# Altium schematic sheet 2312_Ethernet.SchDoc
size A3; Author: Miguel Santos; Organization: ETML-ES; Address1: Avenue Recordon 1; Address2: 1004 Lausanne; Address3: Switzerland; SheetNumber: 4; SheetTotal: 7; Version: 1.0; SPICEModelCacheRYIINKWG: <root> / <DocumentId>RYIINKWG</DocumentId> / </root>
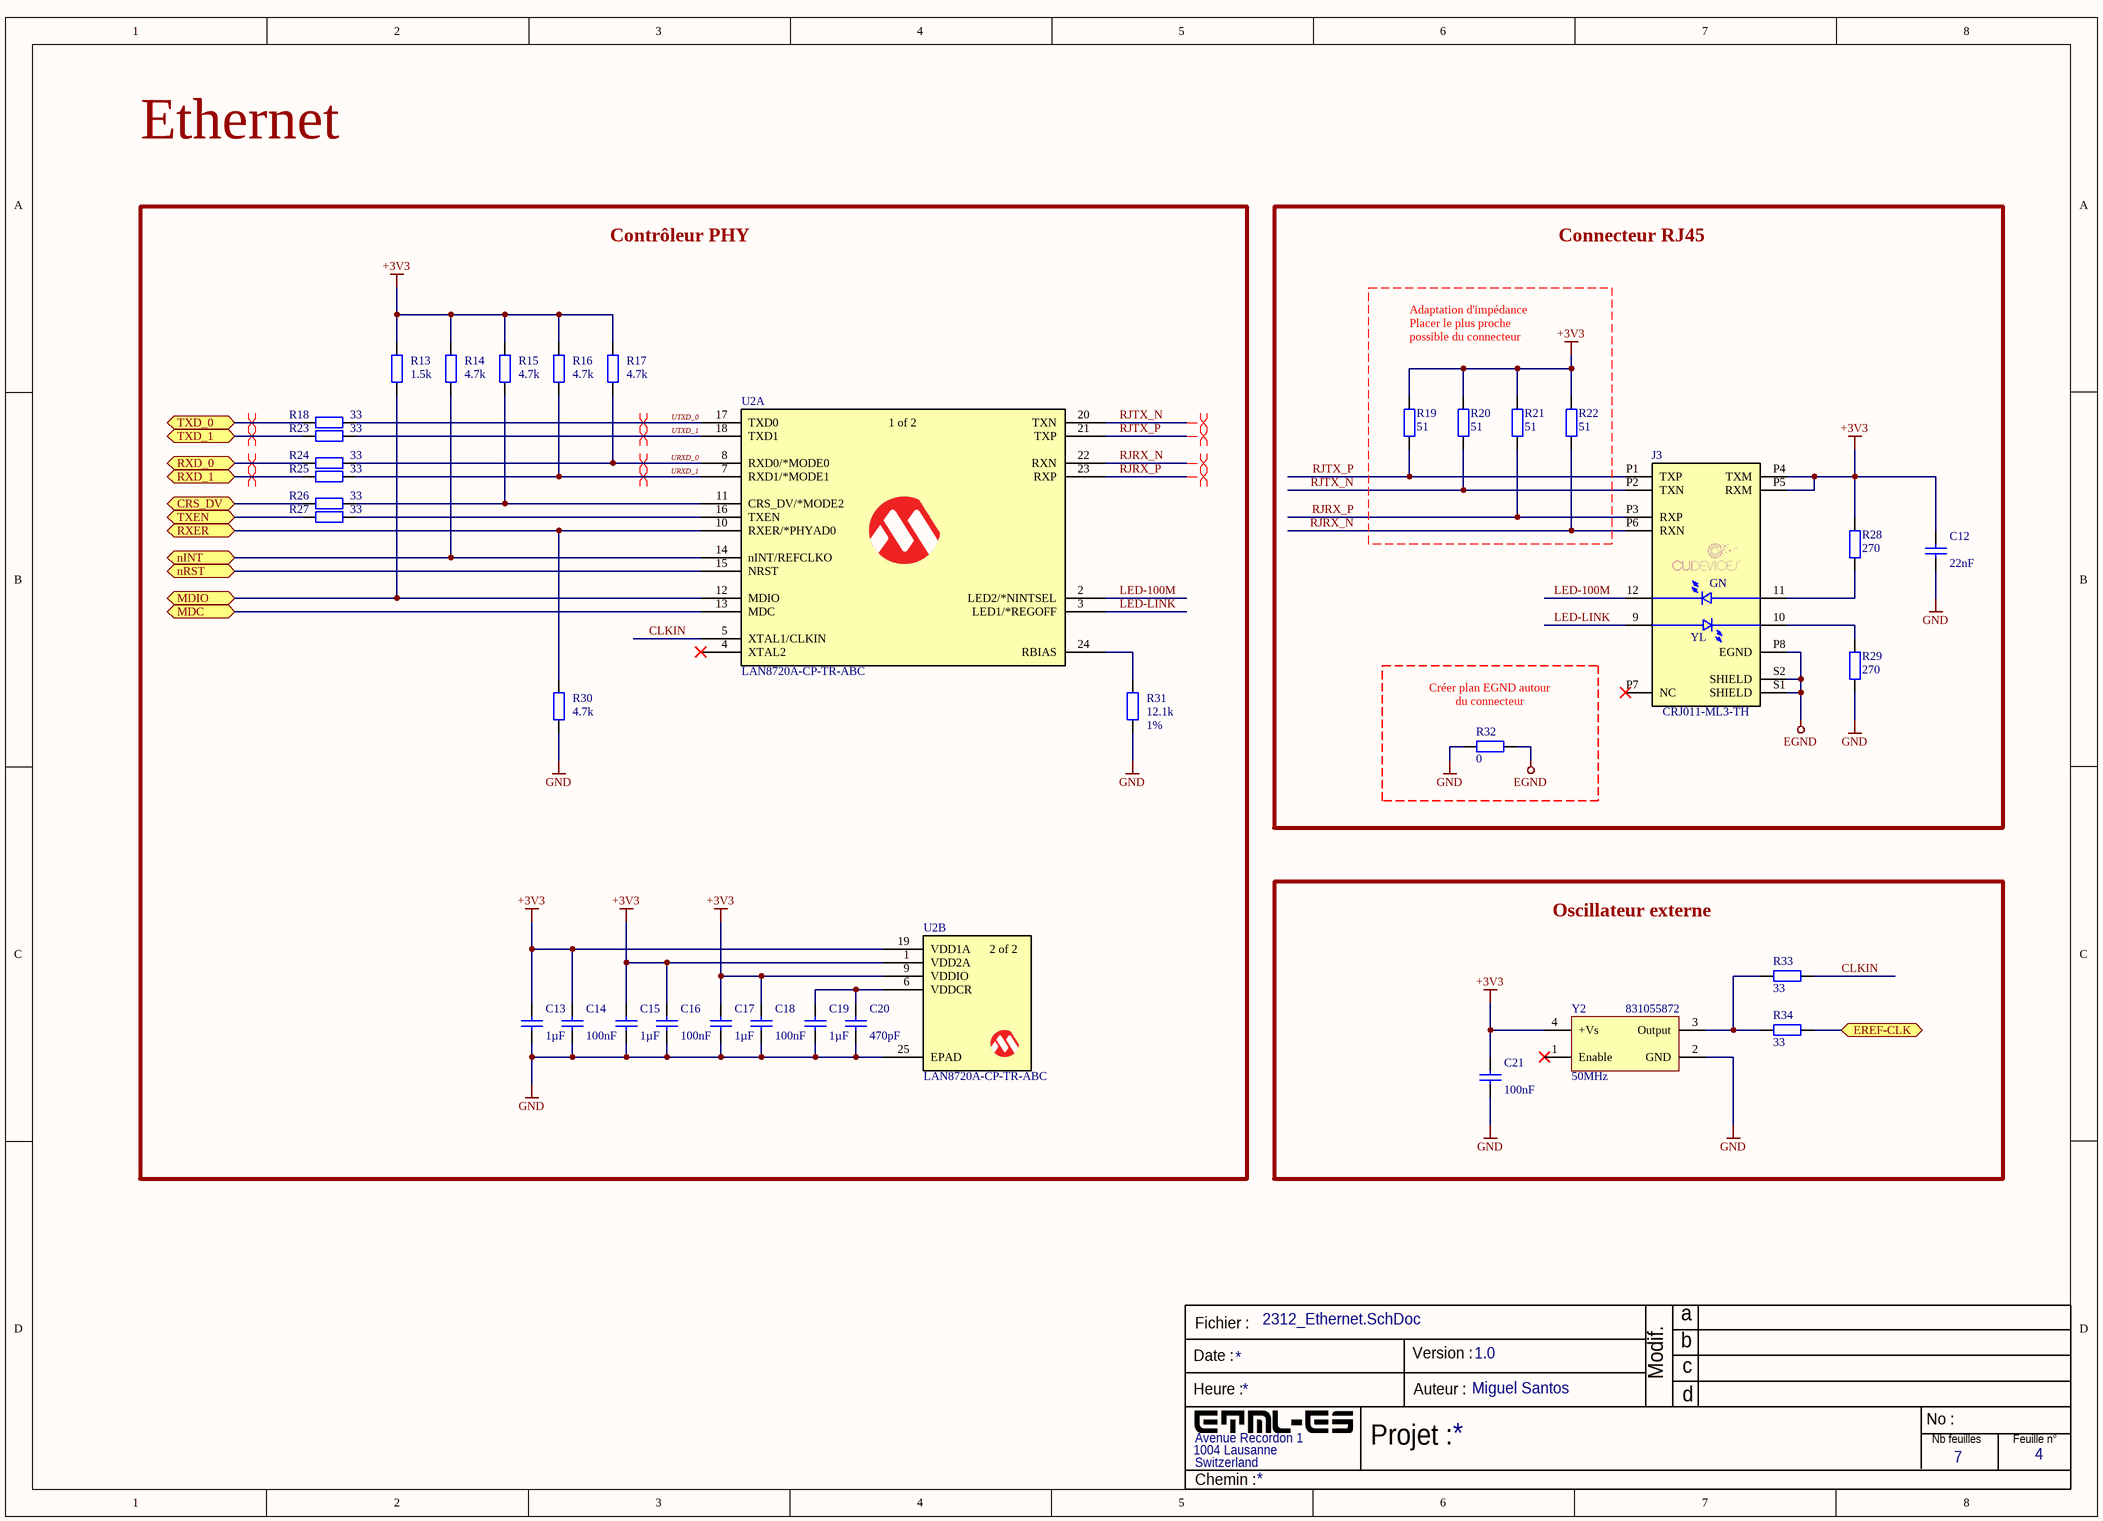
[diagram p0: 2312_Ethernet.SchDoc]

## Parts
C12  Capacitance: 22nF  [WCAP-CSGP_0805_L2W1.25H0.8_Reflow]  (hidden comment: 885012207013)
C13  Capacitance: 1µF  [WCAP-CSGP_0805_L2W1.25H1.25]  (hidden comment: 885012207022)
C14  Capacitance: 100nF  [WCAP-CSGP_0805_L2W1.25H0.8_Reflow]  (hidden comment: 885012207016)
C15  Capacitance: 1µF  [WCAP-CSGP_0805_L2W1.25H1.25]  (hidden comment: 885012207022)
C16  Capacitance: 100nF  [WCAP-CSGP_0805_L2W1.25H0.8_Reflow]  (hidden comment: 885012207016)
C17  Capacitance: 1µF  [WCAP-CSGP_0805_L2W1.25H1.25]  (hidden comment: 885012207022)
C18  Capacitance: 100nF  [WCAP-CSGP_0805_L2W1.25H0.8_Reflow]  (hidden comment: 885012207016)
C19  Capacitance: 1µF  [WCAP-CSGP_0805_L2W1.25H1.25]  (hidden comment: 885012207022)
C20  Capacitance: 470pF  [WCAP-CSGP_0805_L2W1.25H0.8_Reflow]  (hidden comment: 885012007007)
C21  Capacitance: 100nF  [WCAP-CSGP_0805_L2W1.25H0.8_Reflow]  (hidden comment: 885012207016)
J3  CRJ011-ML3-TH  [CUI_CRJ011-ML3-TH]
R13  Resistance: 1.5k  [2312-RES-0805]  (hidden comment: RES-0805)
R14  Resistance: 4.7k  [2312-RES-0805]  (hidden comment: RES-0805)
R15  Resistance: 4.7k  [2312-RES-0805]  (hidden comment: RES-0805)
R16  Resistance: 4.7k  [2312-RES-0805]  (hidden comment: RES-0805)
R17  Resistance: 4.7k  [2312-RES-0805]  (hidden comment: RES-0805)
R18  Resistance: 33  [2312-RES-0805]  (hidden comment: RES-0805)
R19  Resistance: 51  [2312-RES-0805]  (hidden comment: RES-0805)
R20  Resistance: 51  [2312-RES-0805]  (hidden comment: RES-0805)
R21  Resistance: 51  [2312-RES-0805]  (hidden comment: RES-0805)
R22  Resistance: 51  [2312-RES-0805]  (hidden comment: RES-0805)
R23  Resistance: 33  [2312-RES-0805]  (hidden comment: RES-0805)
R24  Resistance: 33  [2312-RES-0805]  (hidden comment: RES-0805)
R25  Resistance: 33  [2312-RES-0805]  (hidden comment: RES-0805)
R26  Resistance: 33  [2312-RES-0805]  (hidden comment: RES-0805)
R27  Resistance: 33  [2312-RES-0805]  (hidden comment: RES-0805)
R28  Resistance: 270  [2312-RES-0805]  (hidden comment: RES-0805)
R29  Resistance: 270  [2312-RES-0805]  (hidden comment: RES-0805)
R30  Resistance: 4.7k  [2312-RES-0805]  (hidden comment: RES-0805)
R31  Resistance: 12.1k  [2312-RES-0805]  (hidden comment: RES-0805)
R32  Resistance: 0  [2312-RES-0805]  (hidden comment: RES-0805)
R33  Resistance: 33  [2312-RES-0805]  (hidden comment: RES-0805)
R34  Resistance: 33  [2312-RES-0805]  (hidden comment: RES-0805)
U2  LAN8720A-CP-TR-ABC  [QFN24-6X6_MC_MCH]  (parts A,B of 2)
Y2  831055872  Frequency: 50MHz  [WE-SPXO_CFPS-39]

## Blocks framed on the sheet
Contrôleur PHY: C13-C20 R13-R18 R23-R27 R30 R31 U2
Connecteur RJ45: C12 J3 R19-R22 R28 R29 R32
Oscillateur externe: C21 R33 R34 Y2

## Ports
CRS_DV (bidir), EREF-CLK (bidir), MDC (bidir), MDIO (bidir), nINT (bidir), nRST (bidir), RXD_0 (bidir), RXD_1 (bidir), RXER (bidir), TXD_0 (bidir), TXD_1 (bidir), TXEN (bidir)

## Nets
+3V3: C12.2 C13.2 C14.2 C15.2 C16.2 C17.2 C18.2 C21.2 J3.P4(TXM) J3.P5(RXM) R13.2 R14.2 R15.2 R16.2 R17.2 R19.2 R20.2 R21.2 R22.2 R28.2 U2.1(VDD2A) U2.9(VDDIO) U2.19(VDD1A) Y2.4(+Vs)
EGND: J3.P8(EGND) J3.S1(SHIELD) J3.S2(SHIELD) R32.1
GND: C12.1 C13.1 C14.1 C15.1 C16.1 C17.1 C18.1 C19.1 C20.1 C21.1 R29.1 R30.1 R31.1 R32.2 U2.25(EPAD) Y2.2(GND)
CLKIN: R33.1 U2.5(XTAL1/CLKIN)
CRS_DV: R26.2 ; port CRS_DV
EREF-CLK: R34.1 ; port EREF-CLK
LED-100M: J3.12 U2.2(LED2/*NINTSEL)
LED-LINK: J3.9 U2.3(LED1/*REGOFF)
MDC: U2.13(MDC) ; port MDC
MDIO: R13.1 U2.12(MDIO) ; port MDIO
nINT: R14.1 U2.14(nINT/REFCLKO) ; port nINT
nRST: U2.15(NRST) ; port nRST
RJRX_N: J3.P6(RXN) R22.1 U2.22(RXN)
RJRX_P: J3.P3(RXP) R21.1 U2.23(RXP)
RJTX_N: J3.P2(TXN) R20.1 U2.20(TXN)
RJTX_P: J3.P1(TXP) R19.1 U2.21(TXP)
RXD_0: R24.2 ; port RXD_0
RXD_1: R25.2 ; port RXD_1
RXER: R30.2 U2.10(RXER/*PHYAD0) ; port RXER
TXD_0: R18.2 ; port TXD_0
TXD_1: R23.2 ; port TXD_1
TXEN: R27.2 ; port TXEN
URXD_0: R17.1 R24.1 U2.8(RXD0/*MODE0)
URXD_1: R16.1 R25.1 U2.7(RXD1/*MODE1)
UTXD_0: R18.1 U2.17(TXD0)
UTXD_1: R23.1 U2.18(TXD1)
NetC19_2: C19.2 C20.2 U2.6(VDDCR)
NetJ3_10: J3.10 R29.2
NetJ3_11: J3.11 R28.1
NetR15_1: R15.1 R26.1 U2.11(CRS_DV/*MODE2)
NetR27_1: R27.1 U2.16(TXEN)
NetR31_2: R31.2 U2.24(RBIAS)
NetR33_2: R33.2 R34.2 Y2.3(Output)

Not connected (* = marked no-connect by the designer): J3 P7(NC)*; U2 4(XTAL2)*; Y2 1(Enable)*

## Layout directives
differential pair: RJRX_N, RJRX_P, RJTX_N, RJTX_P, RXD_0, RXD_1, TXD_0, TXD_1, URXD_0, URXD_1, UTXD_0, UTXD_1

## Notes on the sheet
- Ethernet
- Adaptation d'impédance
  Placer le plus proche possible du connecteur
- (near R31) 1%
- (near R32) Créer plan EGND autour du connecteur
- Fichier :
- a
- Date :
- Heure :
- Version :
- Auteur :
- Modif.
- b
- c
- d
- Projet :
- No :
- Nb feuilles
- Feuille n°
- Chemin :
- (in symbol CRJ011-ML3-TH) GN; YL
- (in symbol LAN8720A-CP-TR-ABC, part A) 1 of 2
- (in symbol LAN8720A-CP-TR-ABC, part B) 2 of 2

## Library data of the parts
C12 = 885012207013: WCAP-CSGP Multilayer Ceramic Chip Capacitor, General Purpose, size 0805, X7R, 22nF, 10VDC; Manufacturer: Wurth Elektronik; Case/Size Code: 0805; Capacitance Tolerance: +/-10%; Dissipation Factor: 5%; Insulation Resistance: 10GΩ; Rated Voltage (DC): 10V; Technical Reference: X7R0805223K010DFCT10000; Manufacturer Part Number: 885012207013; Category: Multilayer Ceramic Chip Capacitors; Match Code: WCAP-CSGP; ComponentLink1Description: Website Link; ComponentLink1URL: https://www.we-online.com/redexpert/article/885012207013?ad; ComponentLink2Description: Datasheet Link; ComponentLink2URL: https://www.we-online.com/redexpert/spec/885012207013?ad; Mount: Surface Mount; Operating Temperature Max: 125°C; Operating Temperature Min: -55°C; Packaging: Tape and Reel; Length: 2mm; Width: 1.25mm; Height: 0.8mm; Ceramic Type: X7R
C13 C15 C17 C19 = 885012207022: WCAP-CSGP Multilayer Ceramic Chip Capacitor, General Purpose, size 0805, X7R, 1µF, 10VDC; Manufacturer: Wurth Elektronik; Case/Size Code: 0805; Capacitance Tolerance: +/-10%; Dissipation Factor: 5%; Insulation Resistance: 0.5GΩ; Rated Voltage (DC): 10V; Technical Reference: X7R0805105K010DFCT10000; Manufacturer Part Number: 885012207022; Category: Multilayer Ceramic Chip Capacitors; Match Code: WCAP-CSGP; ComponentLink1Description: Website Link; ComponentLink1URL: https://www.we-online.com/redexpert/article/885012207022?ad; ComponentLink2Description: Datasheet Link; ComponentLink2URL: https://www.we-online.com/redexpert/spec/885012207022?ad; Mount: Surface Mount; Operating Temperature Max: 125°C; Operating Temperature Min: -55°C; Packaging: Tape and Reel; Length: 2mm; Width: 1.25mm; Height: 1.25mm; Ceramic Type: X7R
C14 C16 C18 C21 = 885012207016: WCAP-CSGP Multilayer Ceramic Chip Capacitor, General Purpose, size 0805, X7R, 100nF, 10VDC; Manufacturer: Wurth Elektronik; Case/Size Code: 0805; Capacitance Tolerance: +/-10%; Dissipation Factor: 5%; Insulation Resistance: 5GΩ; Rated Voltage (DC): 10V; Technical Reference: X7R0805104K010DFCT10000; Manufacturer Part Number: 885012207016; Category: Multilayer Ceramic Chip Capacitors; Match Code: WCAP-CSGP; ComponentLink1Description: Website Link; ComponentLink1URL: https://www.we-online.com/redexpert/article/885012207016?ad; ComponentLink2Description: Datasheet Link; ComponentLink2URL: https://www.we-online.com/redexpert/spec/885012207016?ad; Mount: Surface Mount; Operating Temperature Max: 125°C; Operating Temperature Min: -55°C; Packaging: Tape and Reel; Length: 2mm; Width: 1.25mm; Height: 0.8mm; Ceramic Type: X7R
C20 = 885012007007: WCAP-CSGP Multilayer Ceramic Chip Capacitor, General Purpose, size 0805, NP0, 470pF, 10VDC; Manufacturer: Wurth Elektronik; Case/Size Code: 0805; Capacitance Tolerance: +/-5%; Insulation Resistance: 10GΩ; Q Factor: 1000; Rated Voltage (DC): 10V; Technical Reference: NP00805471J010DFCT10000; Manufacturer Part Number: 885012007007; Category: Multilayer Ceramic Chip Capacitors; Match Code: WCAP-CSGP; ComponentLink1Description: Website Link; ComponentLink1URL: https://www.we-online.com/redexpert/article/885012007007?ad; ComponentLink2Description: Datasheet Link; ComponentLink2URL: https://www.we-online.com/redexpert/spec/885012007007?ad; Mount: Surface Mount; Operating Temperature Max: 125°C; Operating Temperature Min: -55°C; Packaging: Tape and Reel; Length: 2mm; Width: 1.25mm; Height: 0.8mm; Ceramic Type: NP0
J3 = CRJ011-ML3-TH: Modular Jack; Availability: Unavailable; Package: None; Price: None; MP: CRJ011-ML3-TH; Value: *
R13 = RES-0805: SMD Resistor 0805, 1.5kΩ
R14-R17 R30 = RES-0805: SMD Resistor 0805, 4.7kΩ
R18 R23-R27 R33 R34 = RES-0805: SMD Resistor 0805, 33Ω
R19-R22 = RES-0805: SMD Resistor 0805, 51Ω
R28 R29 = RES-0805: SMD Resistor 0805, 270Ω
R31 = RES-0805: SMD Resistor 0805, 12.1kΩ
R32 = RES-0805: SMD Resistor 0805, 0Ω
U2 = LAN8720A-CP-TR-ABC: No Description Available; Mfr_Name: Microchip; Digi-Key_Part_Number_3: LAN8720A-CP-TR-ABCTR-ND; Digi-Key_Part_Number_2: LAN8720A-CP-TR-ABCDKR-ND; Digi-Key_Part_Number_1: LAN8720A-CP-TR-ABCCT-ND; RefDes: RefDes; Type: Type
Y2 = 831055872: WE-SPXO Simple Packaged Quartz Oscillator, SMT, CFPS-39, 50MHz, 3.3V; Manufacturer: Wurth Elektronik; Frequency Stability: +/-25ppm; ComponentLink1Description: Website Link; ComponentLink1URL: https://www.we-online.com/redexpert/article/831055872?ad; ComponentLink2Description: Datasheet Link; ComponentLink2URL: https://www.we-online.com/redexpert/spec/831055872?ad; Manufacturer Part Number: 831055872; Category: Oscillators; Match Code: WE-SPXO; Mount: Surface Mount; Operating Temperature Max: 85°C; Operating Temperature Min: -40°C; Packaging: Tape and Reel; Case/Size Code: CFPS-39; Length: 3.2mm; Width: 2.5mm; Height: 1.2mm; Supply Voltage: 3.3V